# Altium schematic sheet Sheet1.SchDoc
size A4
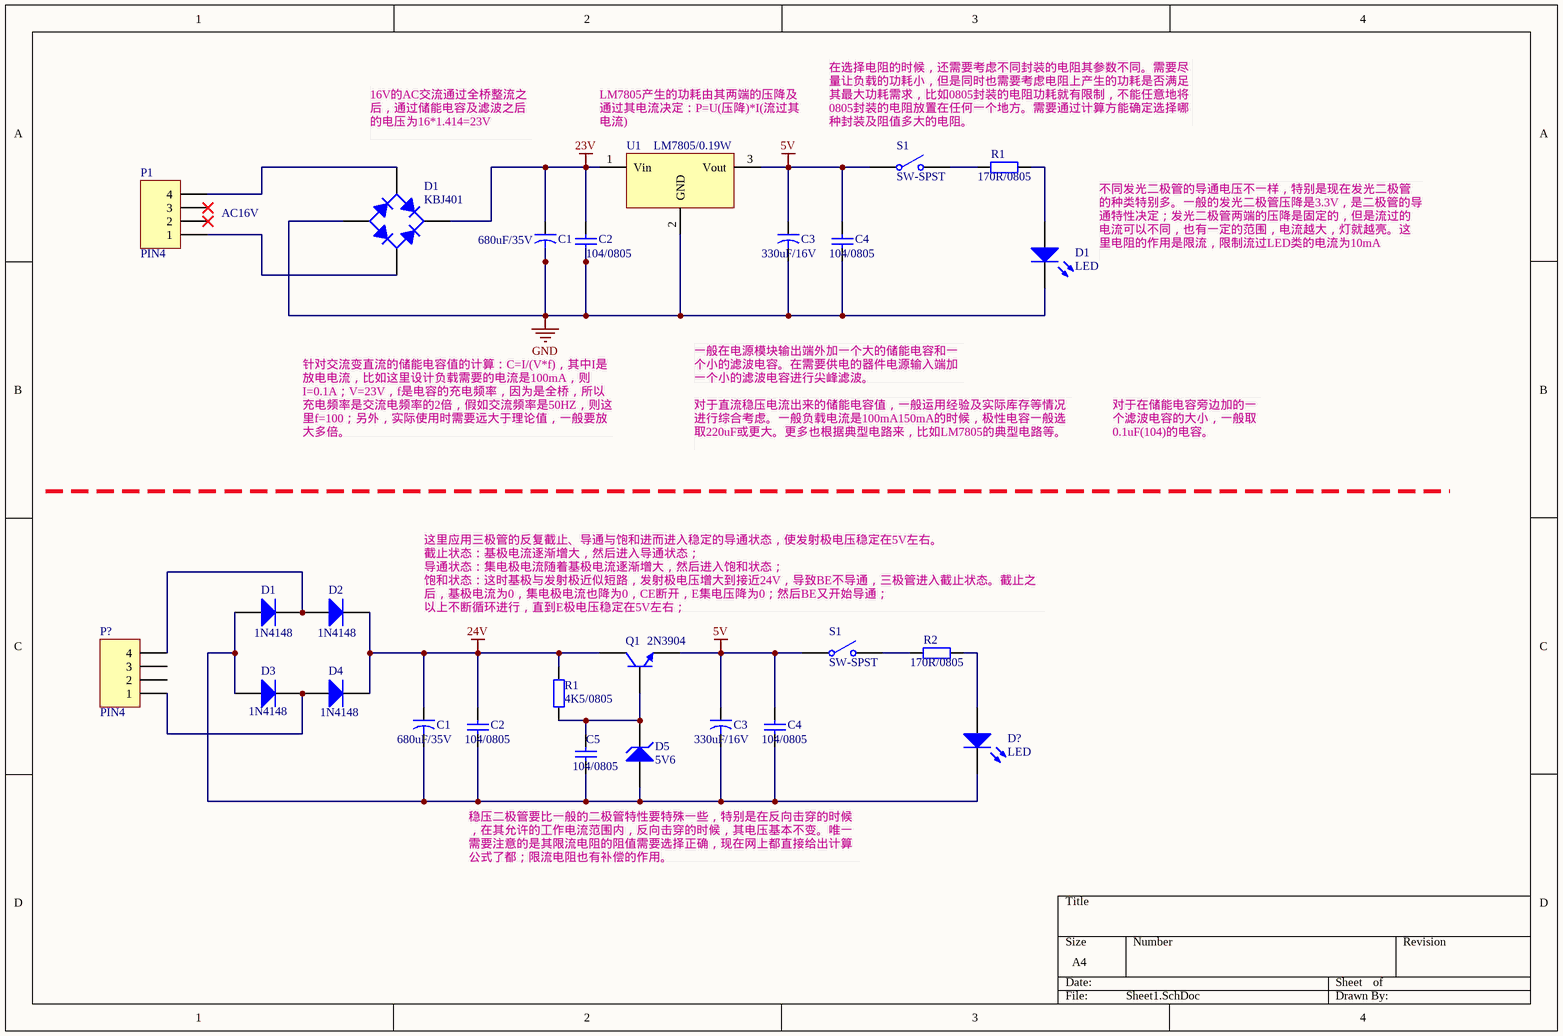
[diagram p0: Sheet1.SchDoc]

## Parts
(Parts that share a designator on the sheet are numbered #1, #2 ... from top to bottom, then left to right.)
C1#1  680uF/35V  [CAPR5-4X5]
C1#2  680uF/35V  [CAPR5-4X5]
C2#1  104/0805  [RAD-0.3]
C2#2  104/0805  [RAD-0.3]
C3#1  330uF/16V  [CAPR5-4X5]
C3#2  330uF/16V  [CAPR5-4X5]
C4#1  104/0805  [RAD-0.3]
C4#2  104/0805  [RAD-0.3]
C5  104/0805  [RAD-0.3]
D1#1  KBJ401  [D-38]
D1#2  LED  [LED-0]
D1#3  1N4148  [DO-35]
D2  1N4148  [DO-35]
D3  1N4148  [DO-35]
D4  1N4148  [DO-35]
D5  5V6  [DIODE-0.7]
D?  LED  [LED-0]
P1  PIN4  [HDR1X4]
P?  PIN4  [HDR1X4]
Q1  2N3904  [TO-92A]
R1#1  170R/0805  [AXIAL-0.4]
R1#2  4K5/0805  [AXIAL-0.4]
R2  170R/0805  [AXIAL-0.4]
S1#1  SW-SPST  [SPST-2]
S1#2  SW-SPST  [SPST-2]
U1  LM7805/0.19W  [VOLT_7805]

## Nets
5V: C3#1.1 C3#2.1 C4#1.2 C4#2.2 Q1.1(E) S1#1.1(COMMON) S1#2.1(COMMON) U1.3(Vout)
23V: C1#1.1 C2#1.2 D1#1.1(K) U1.1(Vin)
24V: C1#2.1 C2#2.2 D2.2(K) D4.2(K) Q1.3(C) R1#2.2
GND: C1#1.2 C2#1.1 C3#1.2 C4#1.1 D1#1.3(A) D1#2.2(K) U1.2(GND)
NetC1#2_2: C1#2.2 C2#2.1 C3#2.2 C4#2.1 C5.1 D1#3.1(A) D3.1(A) D5.1(A) D?.2(K)
NetC5_2: C5.2 D5.2(K) Q1.2(B) R1#2.1
NetD1#1_2: D1#1.2(C) P1.1
NetD1#1_4: D1#1.4(C) P1.4
NetD1#2_1: D1#2.1(A) R1#1.2
NetD1#3_2: D1#3.2(K) D2.1(A) P?.4
NetD3_2: D3.2(K) D4.1(A) P?.1
NetD?_1: D?.1(A) R2.2
NetR1#1_1: R1#1.1 S1#1.2(NO)
NetR2_1: R2.1 S1#2.2(NO)

Not connected (* = marked no-connect by the designer): P1 2* 3*; P? 2 3

## Notes on the sheet
- 16V的AC交流通过全桥整流之后，通过储能电容及滤波之后的电压为16*1.414=23V
- (near U1) LM7805产生的功耗由其两端的压降及通过其电流决定：P=U(压降)*I(流过其电流)
- 在选择电阻的时候，还需要考虑不同封装的电阻其参数不同。需要尽量让负载的功耗小，但是同时也需要考虑电阻上产生的功耗是否满足其最大功耗需求，比如0805封装的电阻功耗就有限制，不能任意地将0805封装的电阻放置在任何一个地方。需要通过计算方能确定选择哪种封装及阻值多大的电阻。
- (near P1) AC16V
- 不同发光二极管的导通电压不一样，特别是现在发光二极管的种类特别多。一般的发光二极管压降是3.3V，是二极管的导通特性决定；发光二极管两端的压降是固定的，但是流过的电流可以不同，也有一定的范围，电流越大，灯就越亮。这里电阻的作用是限流，限制流过LED类的电流为10mA
- 一般在电源模块输出端外加一个大的储能电容和一个小的滤波电容。在需要供电的器件电源输入端加一个小的滤波电容进行尖峰滤波。
- 针对交流变直流的储能电容值的计算：C=I/(V*f)，其中I是放电电流，比如这里设计负载需要的电流是100mA，则I=0.1A；V=23V，f是电容的充电频率，因为是全桥，所以充电频率是交流电频率的2倍，假如交流频率是50HZ，则这里f=100；另外，实际使用时需要远大于理论值，一般要放大多倍。
- 对于直流稳压电流出来的储能电容值，一般运用经验及实际库存等情况进行综合考虑。一般负载电流是100mA150mA的时候，极性电容一般选取220uF或更大。更多也根据典型电路来，比如LM7805的典型电路等。
- 对于在储能电容旁边加的一个滤波电容的大小，一般取0.1uF(104)的电容。
- 这里应用三极管的反复截止、导通与饱和进而进入稳定的导通状态，使发射极电压稳定在5V左右。
  截止状态：基极电流逐渐增大，然后进入导通状态；
  导通状态：集电极电流随着基极电流逐渐增大，然后进入饱和状态；
  饱和状态：这时基极与发射极近似短路，发射极电压增大到接近24V，导致BE不导通，三极管进入截止状态。截止之后，基极电流为0，集电极电流也降为0，CE断开，E集电压降为0；然后BE又开始导通；
  以上不断循环进行，直到E极电压稳定在5V左右；
- 稳压二极管要比一般的二极管特性要特殊一些，特别是在反向击穿的时候，在其允许的工作电流范围内，反向击穿的时候，其电压基本不变。唯一需要注意的是其限流电阻的阻值需要选择正确，现在网上都直接给出计算公式了都；限流电阻也有补偿的作用。

## Library data of the parts
C1#1 C1#2 = Cap2: Capacitor; Value: 680uF; Published: 23-Sep-2002; PackageReference: CAPR5-4X5; Publisher: Altium Limited; PackageDescription: Capacitor; 2 Leads
C2#1 C2#2 = Cap: Capacitor; Value: 100nF; Published: 8-Jun-2000; LatestRevisionDate: 17-Jul-2002; LatestRevisionNote: Re-released for DXP Platform.; PackageReference: RAD-0.3; Publisher: Altium Limited; PackageDescription: Radial Cap, Thru-Hole; 2 Leads; 0.3 in Pin Spacing
C3#1 C3#2 = Cap2: Capacitor; Value: 330uF; Published: 23-Sep-2002; PackageReference: CAPR5-4X5; Publisher: Altium Limited; PackageDescription: Capacitor; 2 Leads
C4#1 C4#2 C5 = Cap: Capacitor; Value: 100uF; Published: 8-Jun-2000; LatestRevisionDate: 17-Jul-2002; LatestRevisionNote: Re-released for DXP Platform.; PackageReference: RAD-0.3; Publisher: Altium Limited; PackageDescription: Radial Cap, Thru-Hole; 2 Leads; 0.3 in Pin Spacing
D1#1 = Bridge1: Full Wave Diode Bridge; Published: 8-Jun-2000; LatestRevisionDate: 29-May-2009; LatestRevisionNote: Sch pins A & K swapped.; DatasheetVersion: E2732B; PackageReference: D-38; Publisher: Altium Limited; PackageDescription: Bridge Rectifier; 4 Terminals; Body 9.4 x 9.4 mm (typ); Pitch 5.08 mm
D1#2 D? = LED0: Typical INFRARED GaAs LED; Published: 8-Jun-2000; LatestRevisionDate: 08-Jul-2005; LatestRevisionNote: Mech Layer 1 removed.; PackageReference: LED-0; Publisher: Altium Limited; PackageDescription: LED; 2 Leads
D1#3 D2-D4 = Diode 1N4148: High Conductance Fast Diode; Published: 8-Jun-2000; LatestRevisionDate: 17-Jul-2002; LatestRevisionNote: Re-released for DXP Platform.; DatasheetVersion: 1997; PackageReference: DO-35; Publisher: Altium Limited; PackageDescription: Diode, Axial; Body 3.8 x 1.9 mm (LxDia. max), Lead Dia. 0.53 mm (max); Code_JEDEC: DO-204-AH; ComponentLink1Description: Manufacturer Link; ComponentLink1URL: http://www.fairchildsemi.com/; ComponentLink2Description: Datasheet; ComponentLink2URL: http://www.fairchildsemi.com/ds/1N%2F1N4148.pdf
D5 = D Zener: Zener Diode; Published: 8-Jun-2000; LatestRevisionDate: 17-Jul-2002; LatestRevisionNote: Re-released for DXP Platform.; PackageReference: DIODE-0.7; Publisher: Altium Limited; PackageDescription: Diode, Thru-Hole; 2 Leads; 0.7 in Pin Spacing
P1 P? = Header 4: Header, 4-Pin; LatestRevisionDate: 17-Jul-2002; LatestRevisionNote: Re-released for DXP Platform.; Publisher: Altium Limited
Q1 = 2N3904: NPN General Purpose Amplifier; Published: 8-Jun-2000; LatestRevisionDate: 15-Jan-2003; LatestRevisionNote: PCB Footprint 'BCY-W3/D4.7' replaced; DatasheetVersion: 1997; PackageVersion: Sep-1998; PackageReference: TO-92A; Publisher: Altium Limited; PackageDescription: TO, Flat Index; 3 In-Line, Axial Leads; Body Dia. 4.5mm; Leads 0.51 x 0.48 mm (max); ComponentLink1Description: Manufacturer Link; ComponentLink1URL: http://www.fairchildsemi.com/; ComponentLink2Description: Datasheet; ComponentLink2URL: http://www.fairchildsemi.com/ds/2N%2F2N3904.pdf
R1#1 R1#2 R2 = Res2: Resistor; Value: 170R; Published: 8-Jun-2000; LatestRevisionDate: 17-Jul-2002; LatestRevisionNote: Re-released for DXP Platform.; PackageReference: AXIAL-0.4; Publisher: Altium Limited; PackageDescription: Axial Device, Thru-Hole; 2 Leads; 0.4 in Pin Spacing
S1#1 S1#2 = SW-SPST: Single-Pole, Single-Throw Switch; Published: 24-Mar-1999; LatestRevisionDate: 17-Jul-2002; LatestRevisionNote: Re-released for DXP Platform.; PackageReference: SPST-2; Publisher: Altium Limited; PackageDescription: Switch; 2 Leads
U1 = VOLT  7805